# EAGLE design PACE (EAGLE 9.6.2)

## Sheet 1 of 3
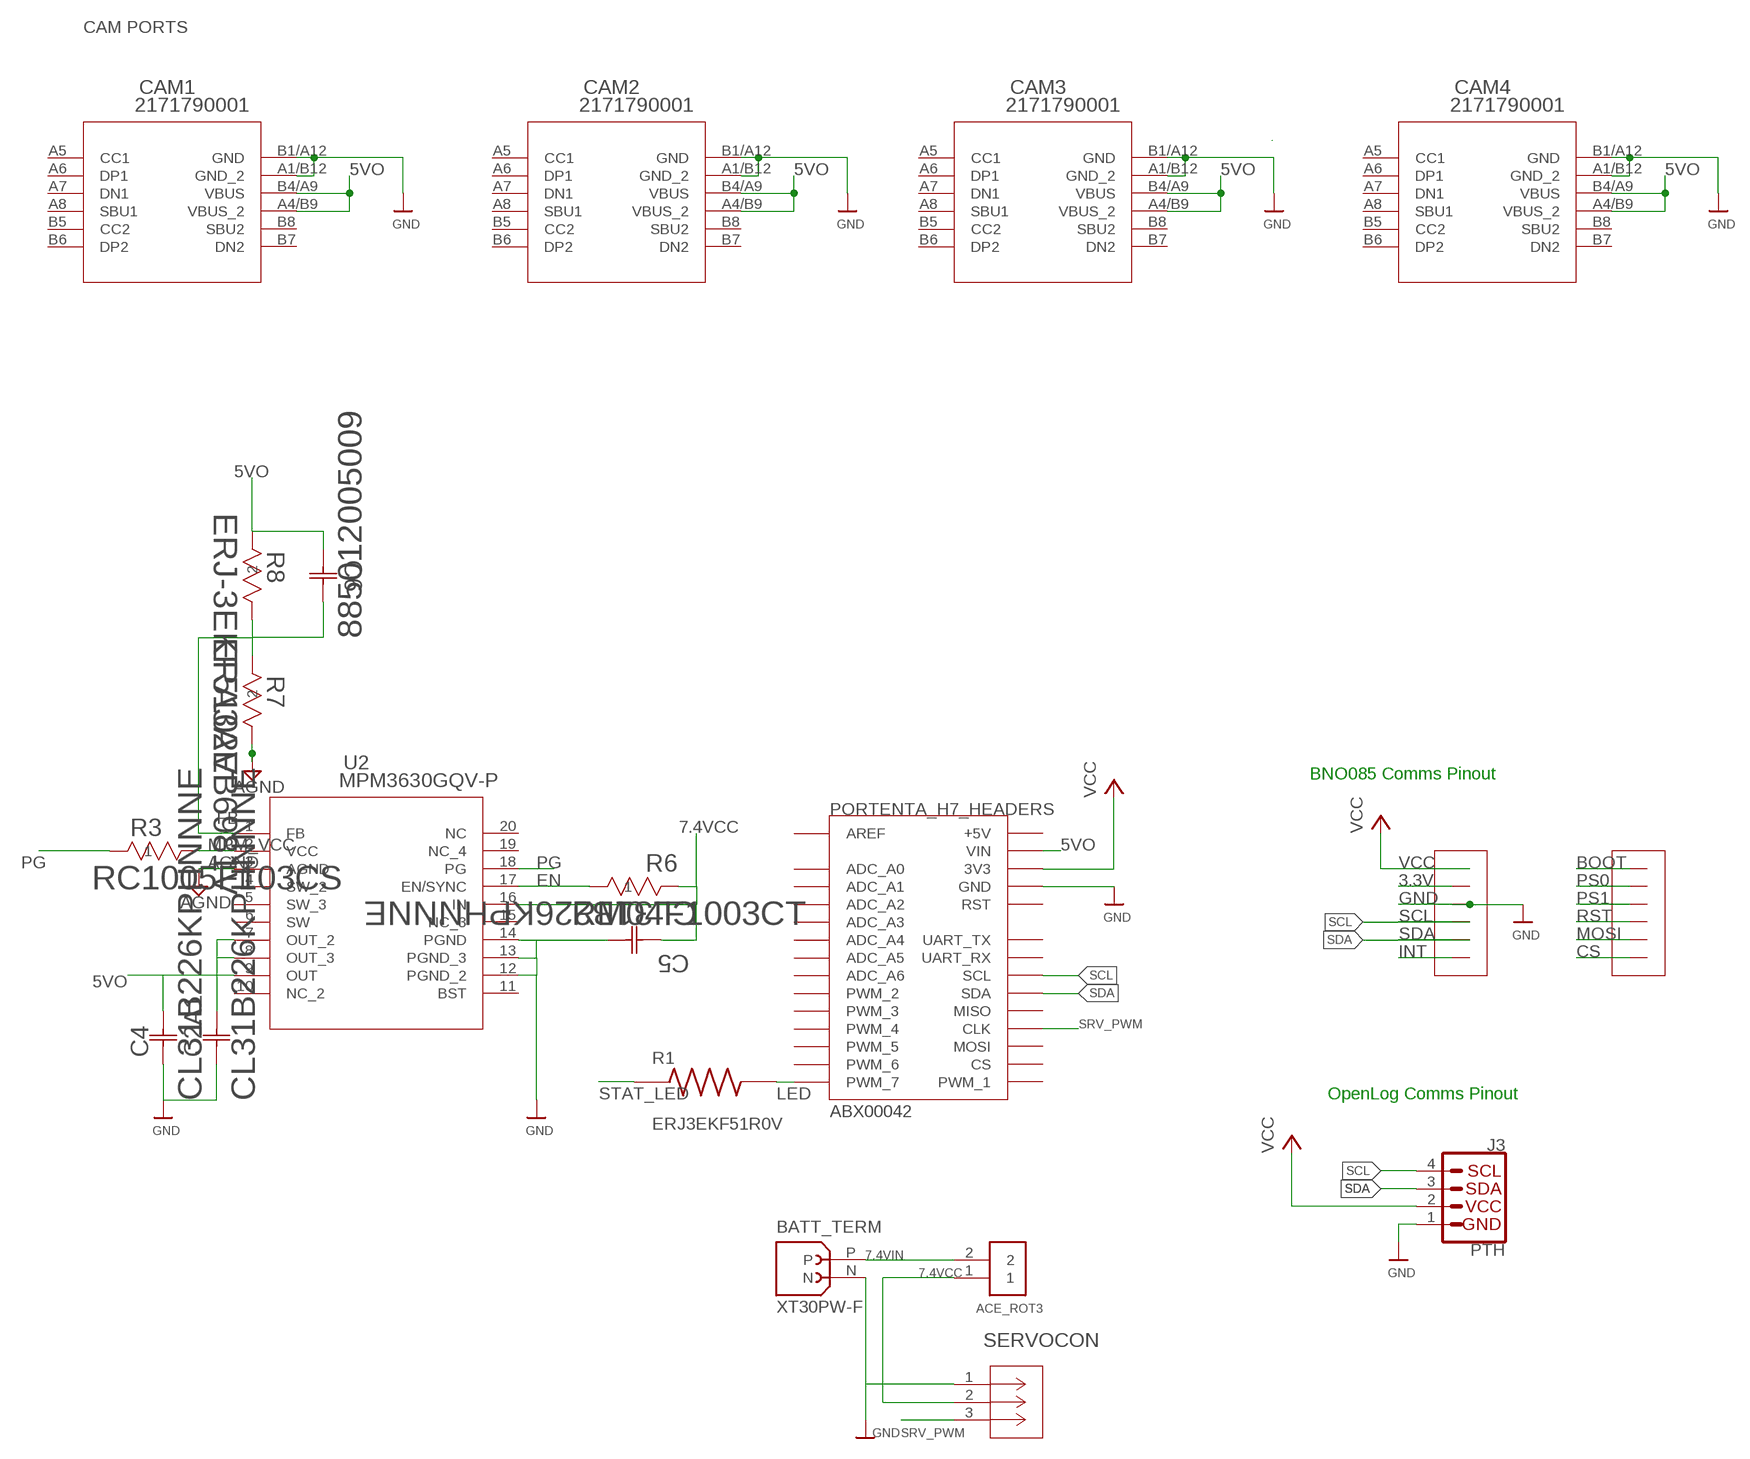
[diagram p0: schematic, sheet 1]

### Parts
ACE_ROT3  282837-2  [TE_282837-2]
BATT_TERM  XT30PW-F  [AMASS_XT30PW-F]
C2A1  CL31B226KPHNNNE  [CAP_CL31_SAM]
C4  CL31B226KPHNNNE  [CAP_CL31_SAM]
C5  CL31B226KPHNNNE  [CAP_CL31_SAM]
C6  885012005009  [CAP_885012005_WRE]
CAM1  2171790001  [2171790001_MOL]
CAM2  2171790001  [2171790001_MOL]
CAM3  2171790001  [2171790001_MOL]
CAM4  2171790001  [2171790001_MOL]
J3  PTH  I2C_STANDARD_NO_SILK  [1X04_NO_SILK]
R1  ERJ3EKF51R0V  [RES_ERJ3EKF51R0V]
R3  RC1005F103CS  [RES_1005_SAM]
R6  RM04F1003CT  [RES_RM04_CCE]
R7  ERA3AEB6981V  [RES_ERA3A_0603_PAN]
R8  ERJ-3EKF5102V  [RC0603N_PAN]
SERVOCON  B03B-PASK-1_(LF)_(SN)  [CONN_B03B-PASK-1_(LF)_(SN)_JST]
U2  MPM3630GQV-P  [QFN3P0X5P0X1P6_MPM3630_MNP]
U$5  ADAFRUIT_BNO08X  [ADAFRUIT_BNO08X_FOOTPRINT]
U$10  ABX00042_HEADERS_IO  [MODULE_ABX00042_HEADERS]

### Nets
5VO: C2A1.2 C4.2 C6.2 CAM1.A4/B9(VBUS_2) CAM1.B4/A9(VBUS) CAM2.A4/B9(VBUS_2) CAM2.B4/A9(VBUS) CAM3.A4/B9(VBUS_2) CAM3.B4/A9(VBUS) CAM4.A4/B9(VBUS_2) CAM4.B4/A9(VBUS) R8.2 U2.7(OUT_2) U2.8(OUT_3) U2.9(OUT) U$10.J16(VIN)
7.4VCC: ACE_ROT3.1 C5.1 R6.2 SERVOCON.2 U2.16(IN)
7.4VIN: ACE_ROT3.2 BATT_TERM.P
AGND: R7.1 U2.3(AGND)
EN: R6.1 U2.17(EN/SYNC)
FB: C6.1 R7.2 R8.1 U2.1(FB)
GND [lowpower]: BATT_TERM.N C2A1.1 C4.1 C5.2 CAM1.A1/B12(GND_2) CAM1.B1/A12(GND) CAM2.A1/B12(GND_2) CAM2.B1/A12(GND) CAM3.A1/B12(GND_2) CAM3.B1/A12(GND) CAM4.A1/B12(GND_2) CAM4.B1/A12(GND) J3.1(GND) SERVOCON.1 U2.12(PGND_2) U2.13(PGND_3) U2.14(PGND) U$5.GND U$10.J18(GND) ; also sheet 2,3
LED: R1.2 U$10.J9(PWM_7)
MPM_VCC: R3.2 U2.2(VCC)
PG: R3.1 U2.18(PG)
SCL: J3.4(SCL) U$5.SCL U$10.J22(SCL) ; also sheet 2,3
SDA: J3.3(SDA) U$5.SDA U$10.J23(SDA) ; also sheet 2,3
SRV_PWM: SERVOCON.3 U$10.J25(CLK)
STAT_LED: R1.1
VCC [lowpower]: J3.2(VCC) U$5.VIN(VCC) U$10.J17(3V3) ; also sheet 2,3
Unconnected: CAM1.A5(CC1) CAM1.A6(DP1) CAM1.A7(DN1) CAM1.A8(SBU1) CAM1.B5(CC2) CAM1.B6(DP2) CAM1.B7(DN2) CAM1.B8(SBU2) CAM2.A5(CC1) CAM2.A6(DP1) CAM2.A7(DN1) CAM2.A8(SBU1) CAM2.B5(CC2) CAM2.B6(DP2) CAM2.B7(DN2) CAM2.B8(SBU2) CAM3.A5(CC1) CAM3.A6(DP1) CAM3.A7(DN1) CAM3.A8(SBU1) CAM3.B5(CC2) CAM3.B6(DP2) CAM3.B7(DN2) CAM3.B8(SBU2) CAM4.A5(CC1) CAM4.A6(DP1) CAM4.A7(DN1) CAM4.A8(SBU1) CAM4.B5(CC2) CAM4.B6(DP2) CAM4.B7(DN2) CAM4.B8(SBU2) U2.4(SW_2) U2.5(SW_3) U2.6(SW) U2.10(NC_2) U2.11(BST) U2.15(NC_3) U2.19(NC_4) U2.20(NC) U$5.3VO(3.3V) U$5.BT(BOOT) U$5.CS U$5.DI(MOSI) U$5.INT U$5.P0(PS0) U$5.P1(PS1) U$5.RST U$10.J1(AREF) U$10.J2(ADC_A0) U$10.J3(ADC_A1) U$10.J4(ADC_A2) U$10.J5(ADC_A3) U$10.J6(ADC_A4) U$10.J7(ADC_A5) U$10.J8(ADC_A6) U$10.J10(PWM_6) U$10.J11(PWM_5) U$10.J12(PWM_4) U$10.J13(PWM_3) U$10.J14(PWM_2) U$10.J15(+5V) U$10.J19(RST) U$10.J20(UART_TX) U$10.J21(UART_RX) U$10.J24(MISO) U$10.J26(MOSI) U$10.J27(CS) U$10.J28(PWM_1)

### Notes on the sheet
- CAM PORTS
- BNO085 Comms Pinout
- OpenLog Comms Pinout

## Sheet 2 of 3
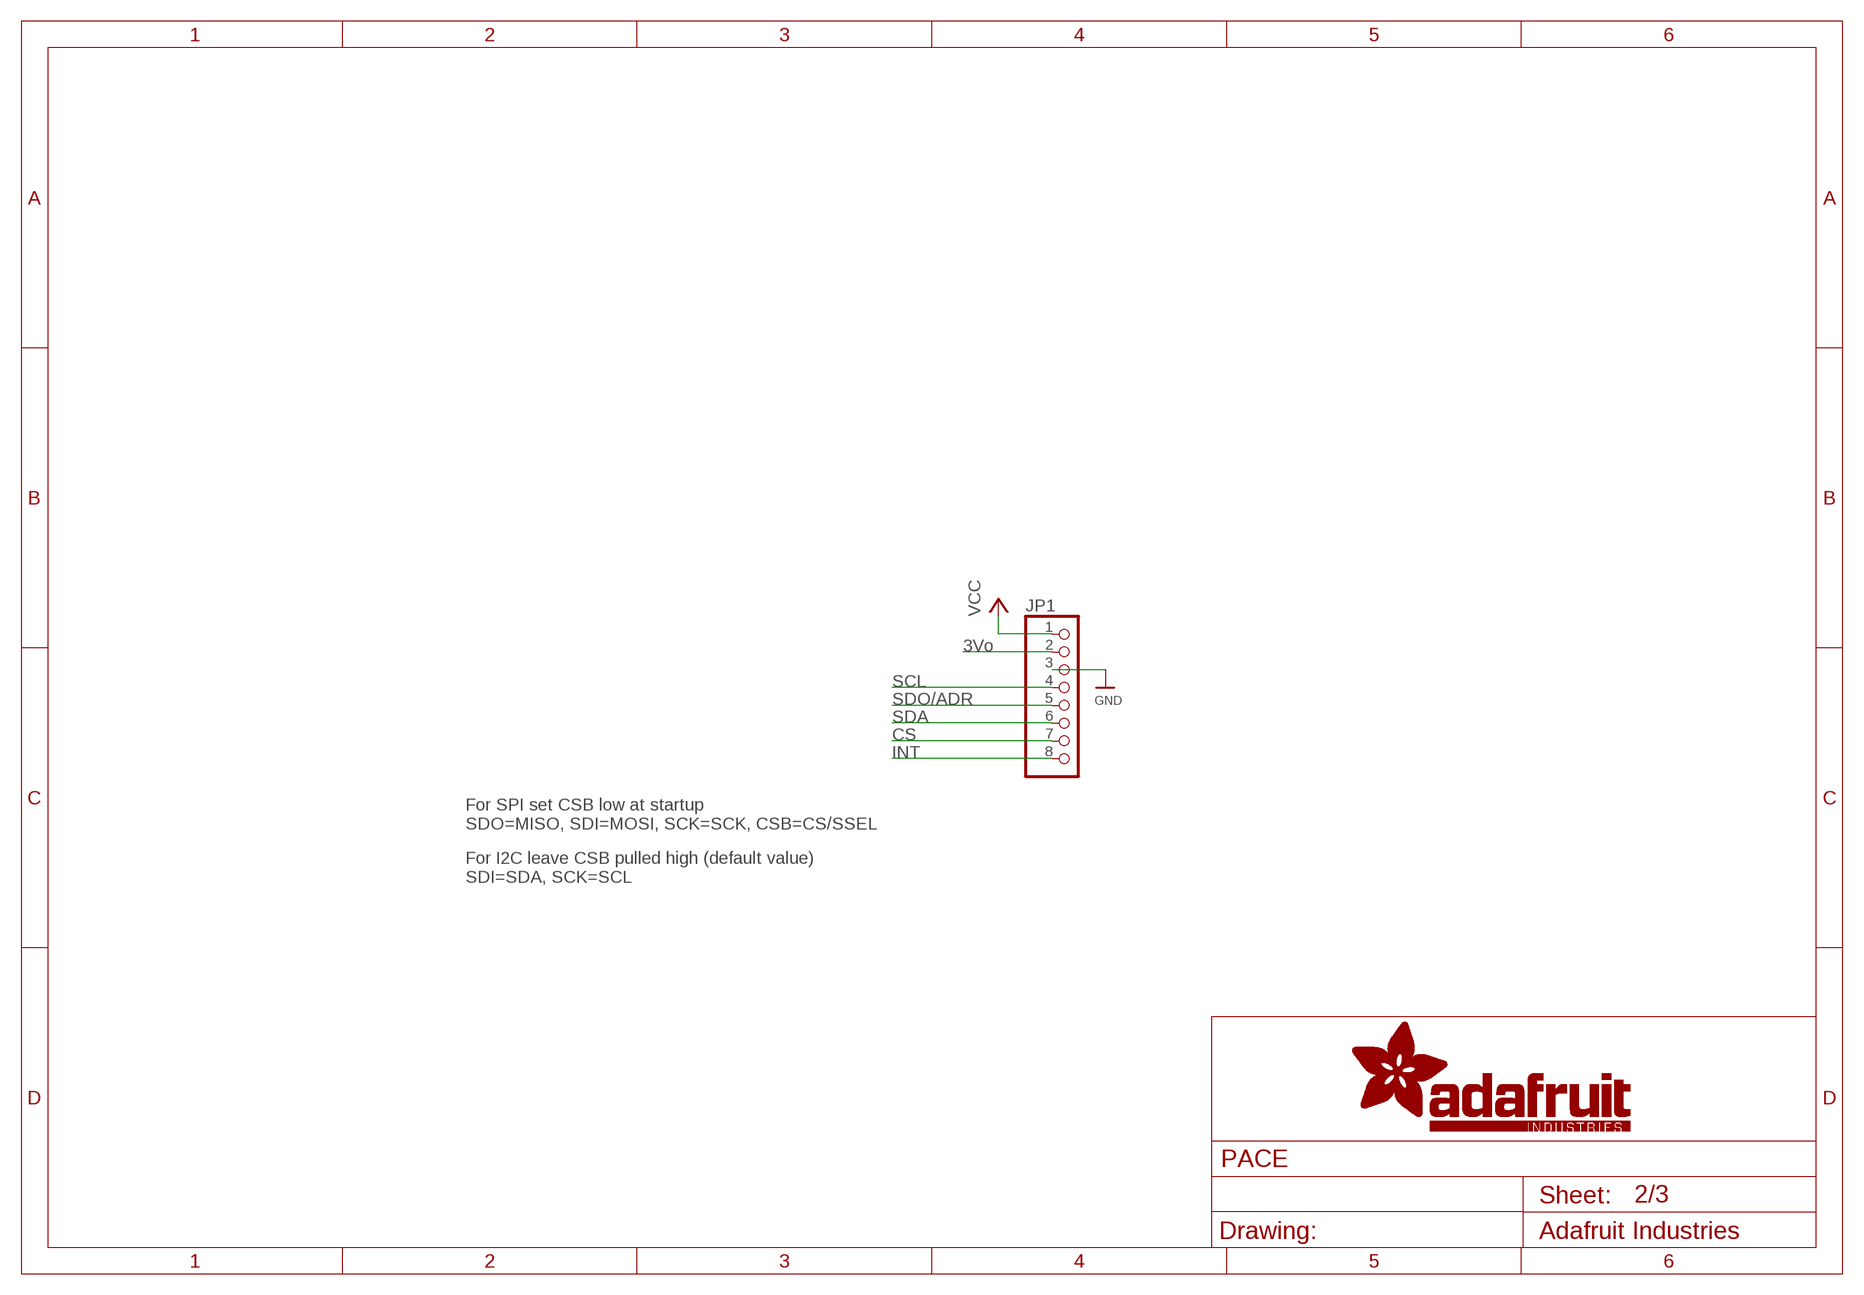
[diagram p1: schematic, sheet 2]

### Parts
JP1  HEADER-1X870MIL  [1X08_ROUND_70]

### Nets
CS: JP1.7
GND [lowpower]: JP1.3 ; also sheet 1,3
INT: JP1.8
N$2 [lowpower]: JP1.2
SCL: JP1.4 ; also sheet 1,3
SDA: JP1.6 ; also sheet 1,3
SDO/ADR: JP1.5
VCC [lowpower]: JP1.1 ; also sheet 1,3

### Notes on the sheet
- 3Vo
- For SPI set CSB low at startup
  SDO=MISO, SDI=MOSI, SCK=SCK, CSB=CS/SSEL
- For I2C leave CSB pulled high (default value)
  SDI=SDA, SCK=SCL

## Sheet 3 of 3
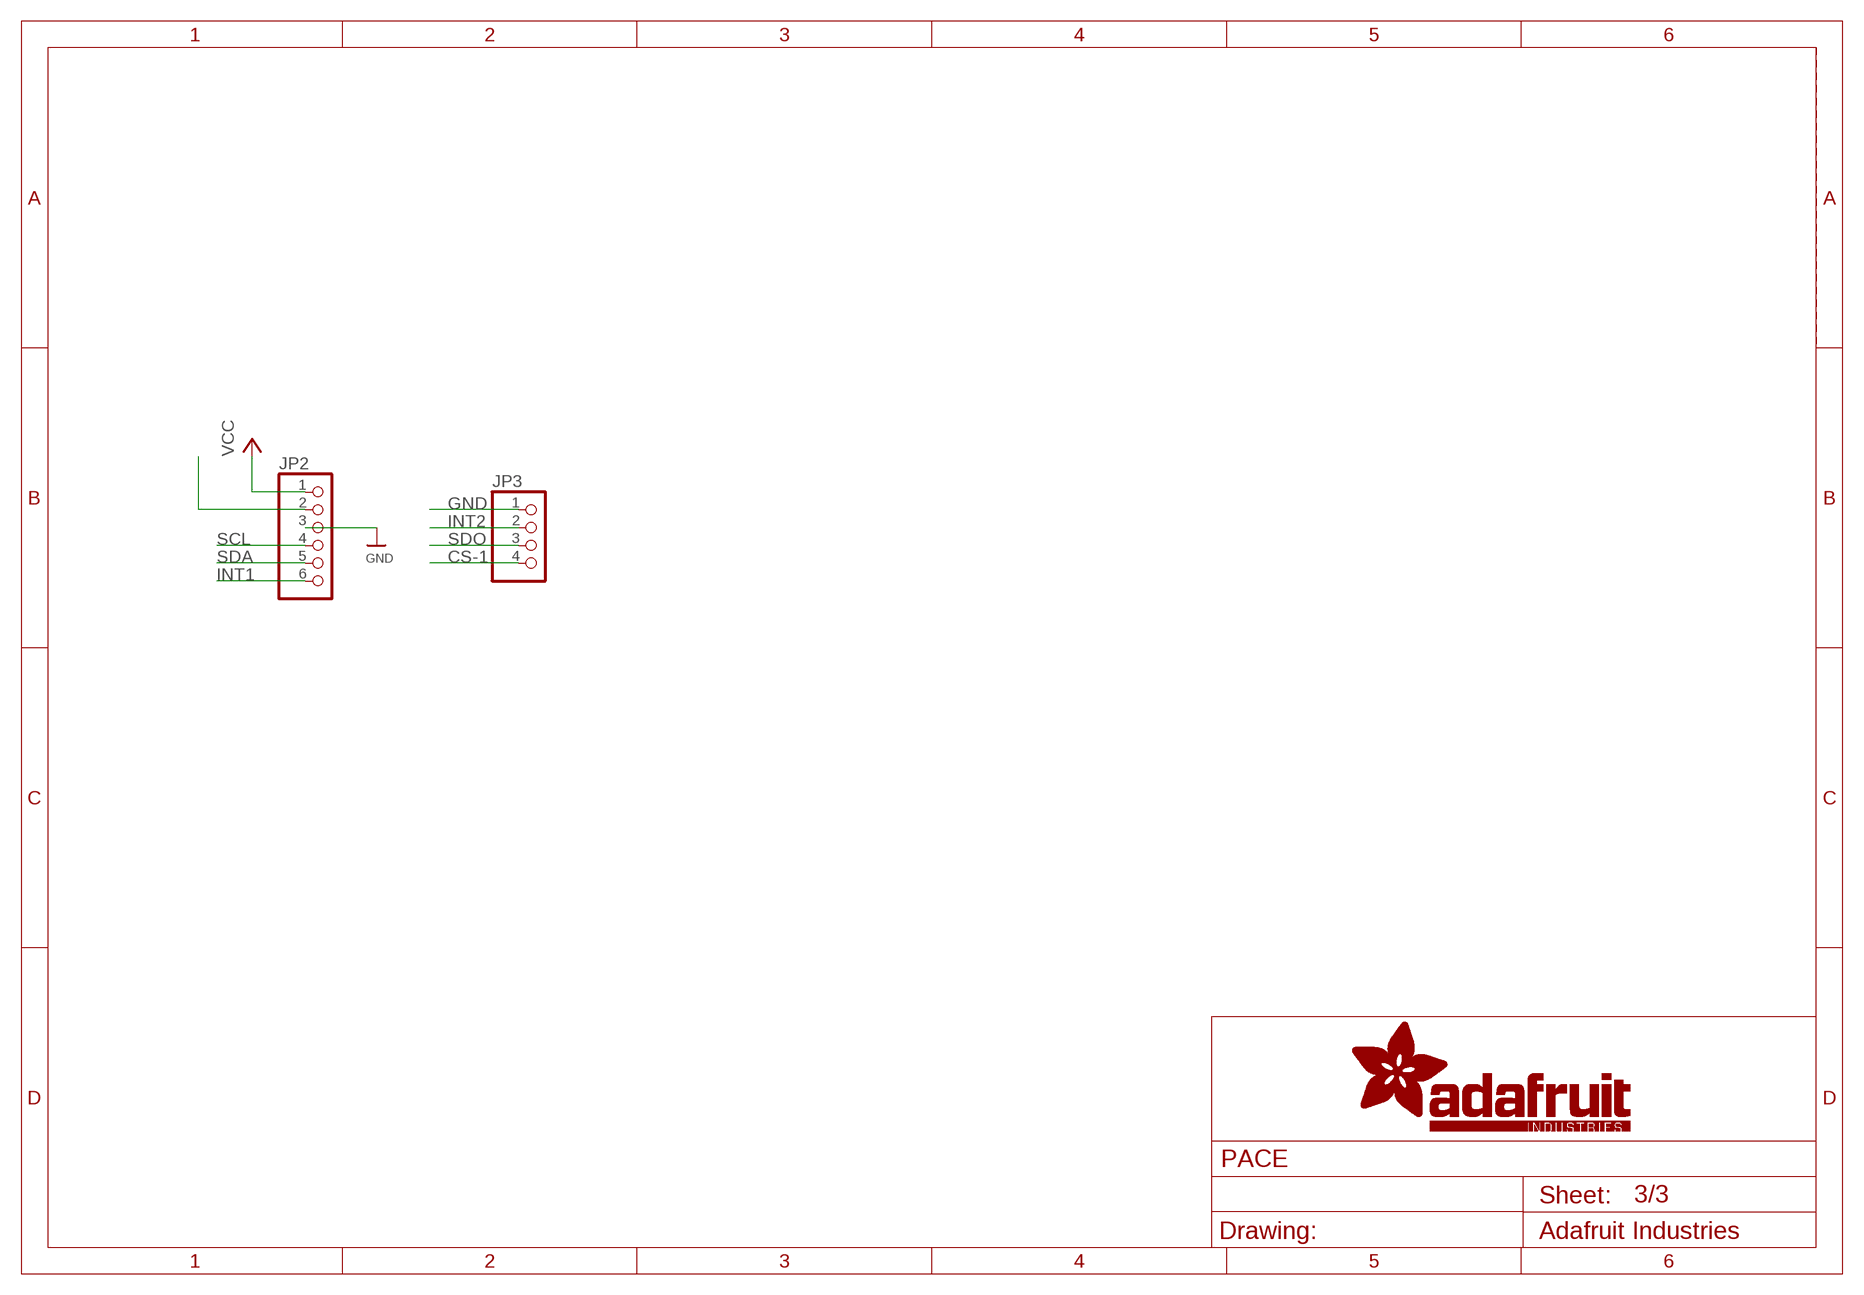
[diagram p2: schematic, sheet 3]

### Parts
JP2  HEADER-1X670MIL  [1X06_ROUND_70]
JP3  HEADER-1X4ROUND  [1X04_ROUND]

### Nets
CS-1: JP3.4
GND [lowpower]: JP2.3 JP3.1 ; also sheet 1,2
INT1: JP2.6
INT2: JP3.2
N$1 [lowpower]: JP2.2
SCL: JP2.4 ; also sheet 1,2
SDA: JP2.5 ; also sheet 1,2
SDO: JP3.3
VCC [lowpower]: JP2.1 ; also sheet 1,2

## Library data of the parts
ACE_ROT3 = 282837-2:282837-2: TERM BLOCK 5.08MM 2POS SIDE ENTY Check availability <https://pricing.snapeda.com/parts/282837-2/TE%20Connectivity/view-part?ref=eda>; AVAILABILITY: In Stock; CHECK_PRICES: https://www.snapeda.com/parts/282837-2/TE+Connectivity+AMP+Connectors/view-part/?ref=eda; COMMENT: 282837-2; DESCRIPTION: Terminal Block Connector Wire Receptacle 2 5.08 mm 30-16 AWG Green 13.5 A 250 V | TE Connectivity 282837-2; MF: TE Connectivity; MP: 282837-2; PACKAGE: None; PRICE: None; PURCHASE-URL: https://www.snapeda.com/api/url_track_click_mouser/?unipart_id=2549980&manufacturer=TE Connectivity&part_name=282837-2&search_term=None; SNAPEDA_LINK: https://www.snapeda.com/parts/282837-2/TE+Connectivity+AMP+Connectors/view-part/?ref=snap
BATT_TERM = XT30PW-F:XT30PW-F: Check availability <https://pricing.snapeda.com/parts/XT30PW-F/amass/view-part?ref=eda>; AVAILABILITY: Not in stock; CHECK_PRICES: https://www.snapeda.com/parts/XT30PW-F/AMASS/view-part/?ref=eda; DESCRIPTION: Socket; DC supply; XT30; female; PIN: 2; on PCBs; THT; yellow; 15A; MF: amass; MP: XT30PW-F; PACKAGE: None; PRICE: None; SNAPEDA_LINK: https://www.snapeda.com/parts/XT30PW-F/AMASS/view-part/?ref=snap
C2A1 C4 C5 = 22uF_Capacitor:CL31B226KPHNNNE; COPYRIGHT: Copyright (C) 2024 Ultra Librarian. All rights reserved.; MANUFACTURER_PART_NUMBER: CL31B226KPHNNNE; MFR_NAME: Samsung
C6 = 22pF_Capacitor:885012005009; COPYRIGHT: Copyright (C) 2024 Ultra Librarian. All rights reserved.; MANUFACTURER_PART_NUMBER: 885012005009; MFR_NAME: Wurth Electronics
CAM1-CAM4 = MOLEX-2171790001-USB_C:2171790001; COPYRIGHT: Copyright (C) 2024 Ultra Librarian. All rights reserved.; MANUFACTURER_PART_NUMBER: 2171790001; MFR_NAME: Molex Connector Corporation
J3 = SparkX:I2C_STANDARD: SparkFun I2C Standard Pinout Header SparkFun has standardized on a pinout for all I2C based sensor breakouts. This pinout allows I2C boards to be plugged directly into the headers on Arduino Uno compatible boards, and to be daisy chained easily. Example SparkFun Products: SparkFun Atmospheric Sensor Breakout - BME280 <https://www.sparkfun.com/products/13676> SparkFun Altitude/Pressure Sensor Breakout - MPL3115A2 <https://www.sparkfun.com/products/11084> SparkFun TOF Range Finder Sensor - VL6180 <https://www.sparkfun.com/products/12785>
JP1 = microbuilder:HEADER-1X8: PIN HEADER
JP2 = microbuilder:HEADER-1X6: PIN HEADER
JP3 = microbuilder:HEADER-1X4: PIN HEADER
R1 = ERJ3EKF51R0V-51Ohm-Resistor:ERJ3EKF51R0V; MANUFACTURER: Panasonic; MAXIMUM_PACKAGE_HEIGHT: 0.45 mm; PARTREV: 3/1/2020; STANDARD: Manufacturer Recommendations
R3 = 10kO_Resistor:RC1005F103CS; COPYRIGHT: Copyright (C) 2024 Ultra Librarian. All rights reserved.; MANUFACTURER_PART_NUMBER: RC1005F103CS; MFR_NAME: Samsung
R6 = 100kO_Resistor:RM04F1003CT; COPYRIGHT: Copyright (C) 2024 Ultra Librarian. All rights reserved.; MANUFACTURER_PART_NUMBER: RM04F1003CT; MFR_NAME: Cal-Chip Electronics
R7 = 6_98kO_Resistor:ERA3AEB6981V; COPYRIGHT: Copyright (C) 2024 Ultra Librarian. All rights reserved.; MANUFACTURER_PART_NUMBER: ERA3AEB6981V; MFR_NAME: Panasonic
R8 = 51kO_Resistor:ERJ-3EKF5102V; COPYRIGHT: Copyright (C) 2024 Ultra Librarian. All rights reserved.; MANUFACTURER_PART_NUMBER: ERJ-3EKF5102V; MFR_NAME: Panasonic
SERVOCON = 3_Pin_JST_XA_Surface_Connector:B03B-PASK-1_(LF)_(SN); COPYRIGHT: Copyright (C) 2024 Ultra Librarian. All rights reserved.; DIGIKEY_PART_NUMBER_1: 455-1833-ND; MANUFACTURER_PART_NUMBER: B03B-PASK-1 (LF) (SN); MFR_NAME: JST
U2 = MPM3630:MPM3630GQV-P; COPYRIGHT: Copyright (C) 2024 Ultra Librarian. All rights reserved.; MANUFACTURER_PART_NUMBER: MPM3630GQV-P; MFR_NAME: Monolithic Power Systems
U$5 = ADAFRUIT_BNO08x:ADAFRUIT_BNO08X: Adafruit BNO08x Device
U$10 = ABX00042:ABX00042_HEADERS_IO: Device for Portenta H7 pin headers IO

## Net classes
1 highpower: width 0.305 mm, drill 0.483 mm
2 lowpower: width 0.254 mm, drill 0.483 mm

## Board
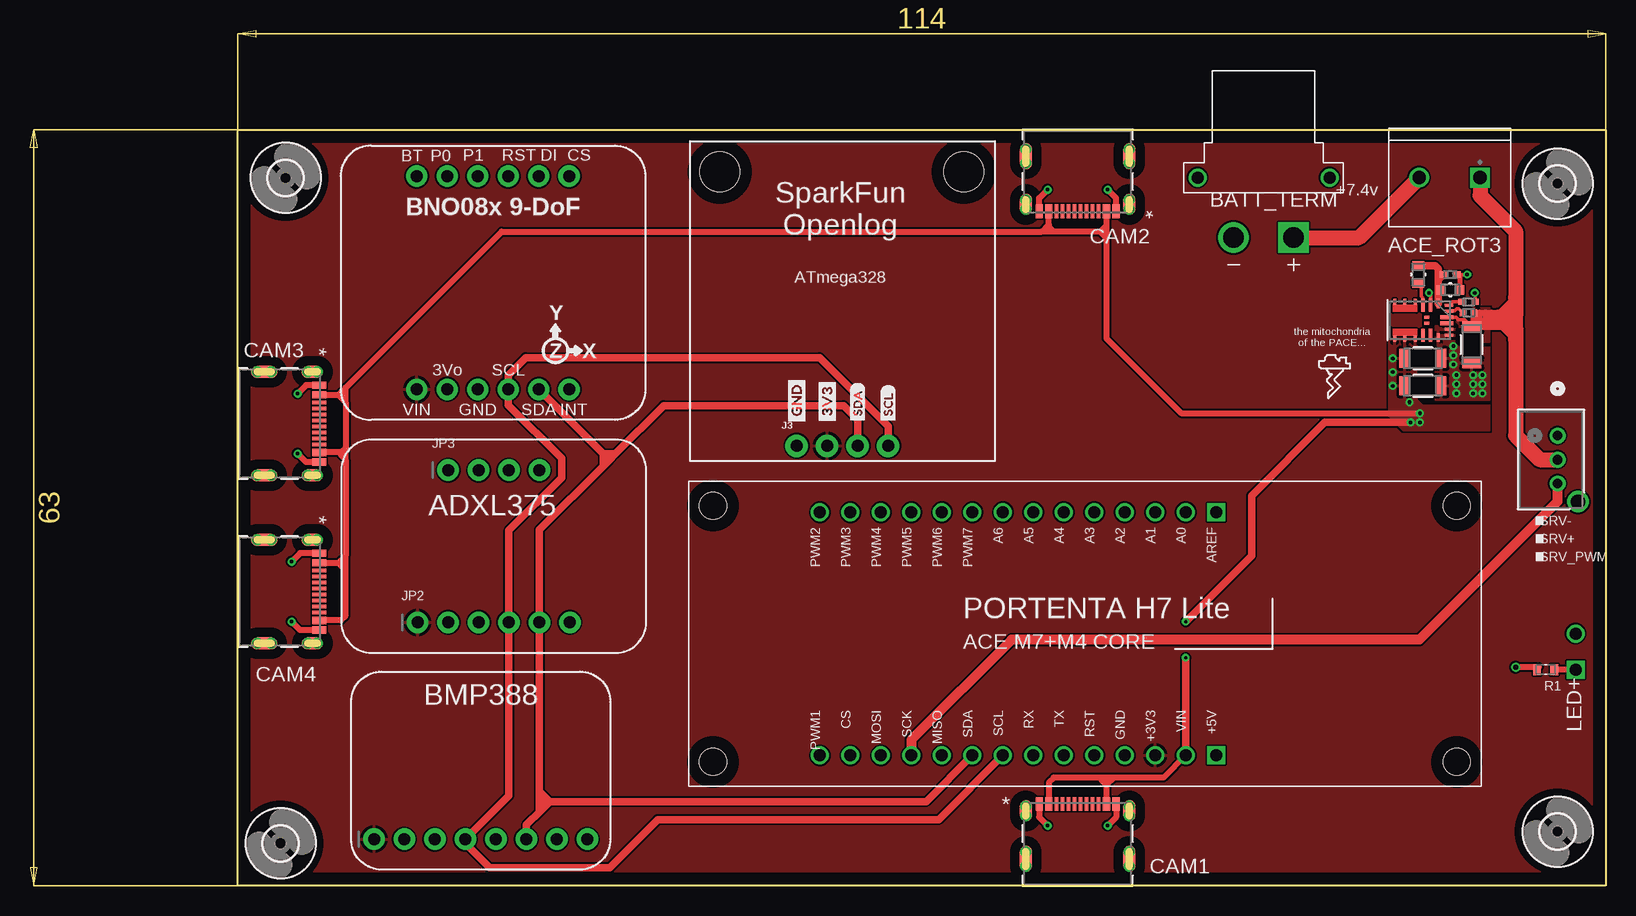
[diagram p3: board, top side]
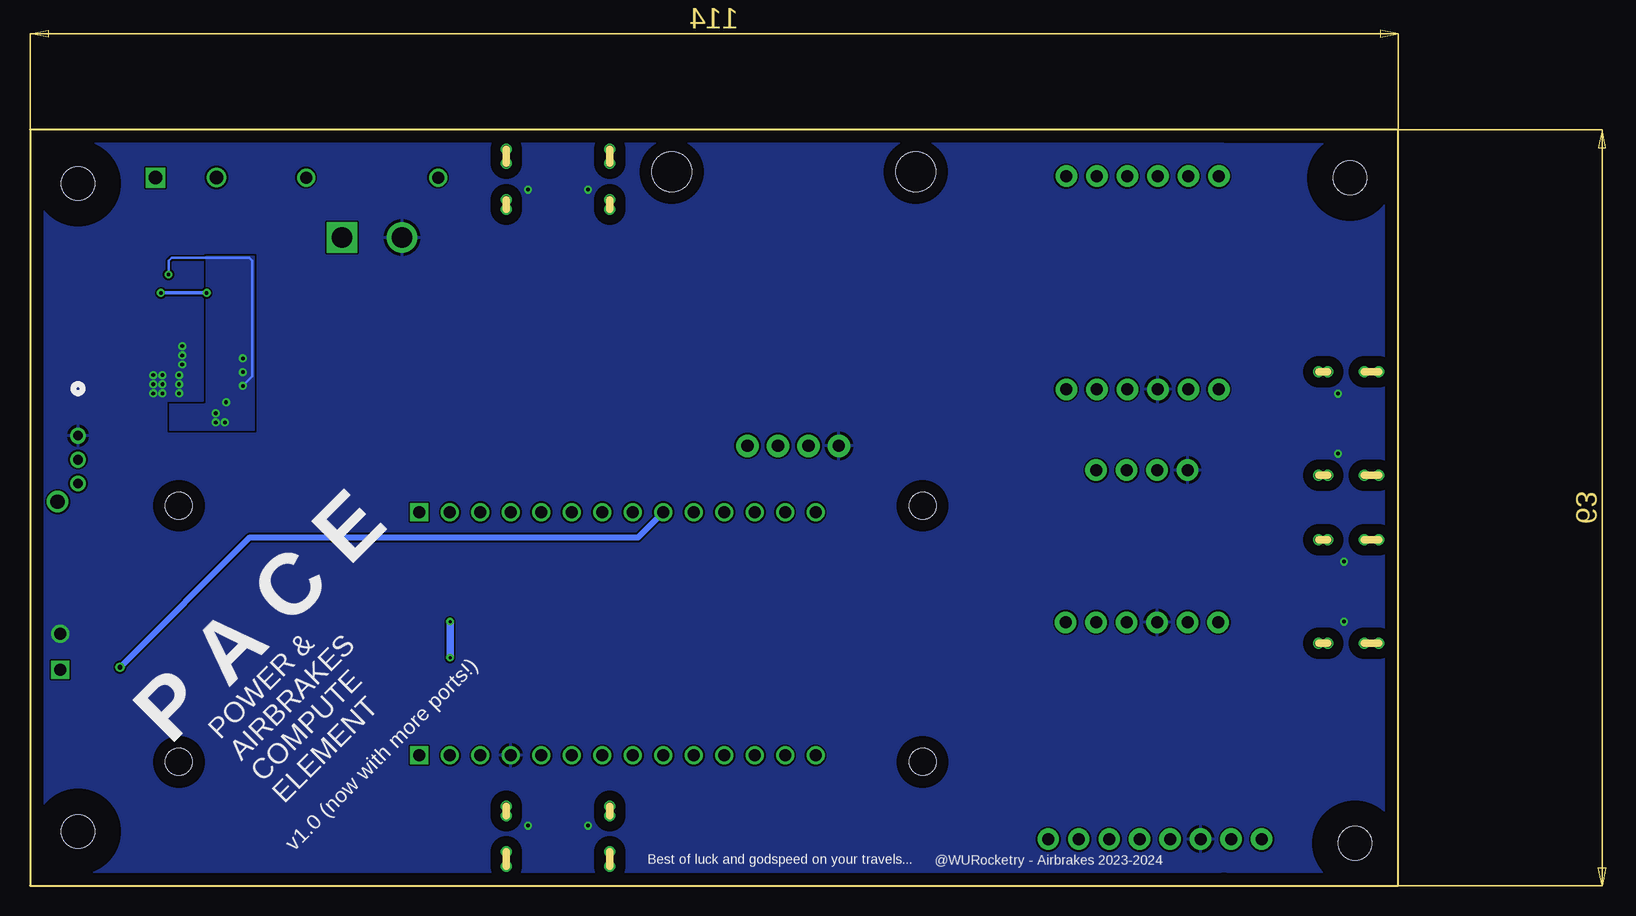
[diagram p4: board, bottom side, seen from below]

Size 114 x 63 mm. Coordinates in mm from the lower left corner, seen from the top.
Outline: 0,63 114,63 114,0 0,0 0,63
Copper layers (1*16): Top 0.035mm / dielectric 1.5mm / Bottom 0.035mm
Design rules "default *": minimum track width 6mil, minimum drill 0.2mm, track to track 6mil, track to pad 6mil, pad to pad 6mil, via to via 6mil, smd to smd 6mil, copper to edge 40mil, drill to drill 8mil, minimum pad ring 5mil, minimum via ring 7mil, stop-mask expansion 4mil, vias tented up to drill 0mil, thermal gap 10mil

### Footprints (pad centres in the part's own frame; a part is rotated, then mirrored left to right if it is on the bottom)
TE_282837-2 = drill 1.1 square: 1 -2.54,0 | drill 1.1: 2 2.54,0
AMASS_XT30PW-F = drill 1.7: N -2.5,-5 | drill 1.7 square: P 2.5,-5 | drill 1: S1 5.5,0; S2 -5.5,0
CAP_CL31_SAM = smd 0.856 x 1.6: 1 -1.528,0; 2 1.528,0
CAP_885012005_WRE = smd 0.66 x 0.559: 1 -0.546,0; 2 0.546,0
2171790001_MOL = smd 0.991 x 2.21: 13 -4.32,-1.272; 14 4.32,-1.272 | smd 0.991 x 1.803: 15 -4.32,2.728; 16 4.32,2.728 | smd 0.61 x 1.143: A1/B12 -3.2,3.303; A4/B9 -2.4,3.303; B1/A12 3.2,3.303; B4/A9 2.4,3.303 | smd 0.305 x 1.143: A5 -1.25,3.303; A6 -0.25,3.303; A7 0.25,3.303; A8 1.25,3.303; B5 1.75,3.303; B6 0.75,3.303; B7 -0.75,3.303; B8 -1.75,3.303 | drill 0.61 pad 0.61: S_1_H1 -4.318,-0.686; S_1_H2 -4.318,-1.88; S_2_H1 4.318,-0.686; S_2_H2 4.318,-1.88; S_3_H1 -4.318,3.124; S_3_H2 -4.318,2.337; S_4_H1 4.318,3.124; S_4_H2 4.318,2.337
1X04_NO_SILK = drill 1.016 pad 1.88: 1 0,0; 2 2.54,0; 3 5.08,0; 4 7.62,0
1X08_ROUND_70 = drill 1 pad 1.778: 1 -8.89,0; 2 -6.35,0; 3 -3.81,0; 4 -1.27,0; 5 1.27,0; 6 3.81,0; 7 6.35,0; 8 8.89,0
1X06_ROUND_70 = drill 1 pad 1.778: 1 -6.35,0; 2 -3.81,0; 3 -1.27,0; 4 1.27,0; 5 3.81,0; 6 6.35,0
1X04_ROUND = drill 1 pad 1.778: 1 -3.81,0; 2 -1.27,0; 3 1.27,0; 4 3.81,0
STAND-OFF = hole 3.302: 0,0
RES_ERJ3EKF51R0V = smd 0.65 x 0.9: 1 -0.725,0; 2 0.725,0
RES_1005_SAM = smd 0.606 x 0.5: 1 -0.553,0; 2 0.553,0
RES_RM04_CCE = smd 0.508 x 0.559: 1 -0.47,0; 2 0.47,0
RES_ERA3A_0603_PAN = smd 0.711 x 0.991: 1 -0.749,0; 2 0.749,0
RC0603N_PAN = smd 0.756 x 0.8: 1 -0.778,0; 2 0.778,0
CONN_B03B-PASK-1_(LF)_(SN)_JST = drill 0.813 pad 1.321: 1 0,0; 2 2.007,0; 3 3.988,0 | drill 1.194 pad 1.194: 4 5.512,1.702
QFN3P0X5P0X1P6_MPM3630_MNP = smd 0.813 x 0.254: 1 -1.394,1.55 | smd 1.092 x 0.305: 2 -1.254,0.9; 3 -1.254,0.25; 10 1.254,0.25; 11 1.254,0.9 | smd 0.508 x 0.254: 4 -1.546,-0.4; 5 -1.546,-1.25; 6 -1.546,-2.1; 7 1.546,-2.1; 8 1.546,-1.25; 9 1.546,-0.4 | smd 0.711 x 0.254: 12 1.444,1.55 | smd 0.254 x 0.711: 13 1.25,2.444; 14 0.75,2.444; 17 -0.75,2.444; 18 -1.25,2.444 | smd 0.305 x 1.092: 15 0.25,2.254; 16 -0.25,2.254 | smd 0.254 x 0.406: 19 -0.25,0.575; 20 0.25,0.575
ADAFRUIT_BNO08X_FOOTPRINT = drill 1 pad 1.778: 3VO 10.16,3.81; BT 7.62,21.59; CS 20.32,21.59; DI 17.78,21.59; GND 12.7,3.81; INT 20.32,3.81; P0 10.16,21.59; P1 12.7,21.59; RST 15.24,21.59; SCL 15.24,3.81; SDA 17.78,3.81; VIN 7.62,3.81
MODULE_ABX00042_HEADERS = drill 1 square: J1 -10.135,10.947; J15 10.135,10.947 | drill 1: J2 -10.135,8.407; J3 -10.135,5.867; J4 -10.135,3.327; J5 -10.135,0.787; J6 -10.135,-1.753; J7 -10.135,-4.293; J8 -10.135,-6.833; J9 -10.135,-9.373; J10 -10.135,-11.913; J11 -10.135,-14.453; J12 -10.135,-16.993; J13 -10.135,-19.533; J14 -10.135,-22.073; J16 10.135,8.407; J17 10.135,5.867; J18 10.135,3.327; J19 10.135,0.787; J20 10.135,-1.753; J21 10.135,-4.293; J22 10.135,-6.833; J23 10.135,-9.373; J24 10.135,-11.913; J25 10.135,-14.453; J26 10.135,-16.993; J27 10.135,-19.533; J28 10.135,-22.073 | hole 2.25: -10.67,30.99; 10.67,30.99; 10.67,-30.99; -10.67,-30.99
2,8 = hole 2.8: 0,0

### Placement (x,y rotation side)
ACE_ROT3  101,59 180 top
BATT_TERM  85.5,59 0 top
C2A1  98.77,41.65 180 top
C4  98.77,43.94 180 top
C5  102.84,45.08 270 top
C6  101.06,50.92 0 top
CAM1  70,3.5 0 top
CAM2  70,59.5 180 top
CAM3  3.5,38.5 270 top
CAM4  3.5,24.5 270 top
J3  46.59,36.65 0 top
JP1  20.26,3.87 0 top
JP2  21.35,21.93 0 top
JP3  21.35,34.63 0 top
JP4  STAND-OFF  [STAND-OFF]  40.19,59.49 0 top
JP5  STAND-OFF  [STAND-OFF]  60.51,59.49 0 top
R1  109,18 180 top
R3  102.58,48.63 0 top
R6  102.58,47.74 0 top
R7  98.39,50.92 90 top
R8  101.06,49.65 0 top
SERVOCON  110,37.5 270 top
U2  98.52,47.11 270 top
U$5  7.31,37.53 0 top
U$8  [3V3-03]  49.13,38.3 90 top
U$9  [GND-03]  46.59,38.3 90 top
U$10  70.6,20.98 270 top
U$13  [2,8]  4,58.98 0 top
U$14  [2,8]  110,58.5 0 top
U$15  [2,8]  3.59,3.53 0 top
U$16  [SDA1]  51.67,38.42 90 top
U$19  [SCL2]  54.21,38.42 90 top
U$29  [2,8]  110,4.5 0 top

### Tracks (layer width: path | path; a pad name or v marks a point on that pad's centre or on a via)
5VO  (via drill 0.25, 0.3, 0.3 pad 0.55)
  Top 0.305: C6.2 v102.46,50.92
  Top 0.406: C6.2 101.84,50.69 R8.2
  Top 0.508: v79.01,18.99 v79,19 | CAM2.A4/B9 72.4,55 | 72.4,55 72.4,54 | 72.4,54 72.4,45.6 78.64,39.36 v98.52,39.36 | 72.4,54 71.9,54.5 | 71.9,54.5 68,54.5 | 68,54.5 67.6,54.9 67.6,55.1 | 72.4,55 71.9,54.5 | 68,54.5 67,54.5 | 67,54.5 22,54.5 9,41.5 | CAM3.A4/B9 8.4,40.9 | 9,41.5 8.4,40.9 | 8.4,40.9 9,40.3 | 9,40.3 9,36.5 | 9,36.5 8.6,36.1 | 8.6,36.1 CAM3.B4/A9 | 8.6,36.1 8.6,35.9 9,35.5 | 9,35.5 9,27.5 | 9,27.5 8.4,26.9 | CAM4.A4/B9 8.4,26.9 | 8.4,26.9 9,26.3 | CAM4.B4/A9 8.6,22.1 9,22.5 9,26.3 | 9,26.3 9,27.5 | 9,35.5 9,36.5 | 9,40.3 9,41.5 | 67,54.5 67.6,55.1 | 67.6,55.1 CAM2.B4/A9 | U$10.J16 77.16,9 73,9 | 73,9 72.4,8.4 | 72.4,8.4 CAM1.B4/A9 | 73,9 72,9 | 72,9 68,9 67.6,8.6 CAM1.A4/B9 | 72.4,8.4 72,8.8 72,9
  Top 0.61: U$10.J16 v79.01,18.99 | v79,22 84.5,27.5 84.5,32.5 90.6,38.6 v97.76,38.6
  Bottom 0.203: v96.26,41.65 95.47,42.44 95.47,52.06 95.73,52.32 102.2,52.32 102.46,52.06 v102.46,50.92
  Bottom 0.61: v79,19 v79,22
  other vias: 98.52,38.6 97.66,40.28 96.26,42.79 96.26,43.94
  pour Top: 104.36,40 98.77,40 98.27,40.51 98.27,46.35 95.93,46.35 95.93,39.16 97.12,37.97 104.36,37.97
  pour Bottom: 102.33,40.12 99.41,40.12 99.28,40.25 99.28,52.44 95.34,52.44 95.34,37.97 102.33,37.97
7.4VCC
  Top 0.305: C5.1 102.28,47.16 101.73,47.16 101.53,47.36 U2.16
  Top 0.508: 103.5,47.74 R6.2 103.05,46.82 C5.1 103.5,47.27 103.5,47.74 | 103.5,47.74 104,47.74 | 104,47.74 104.5,47.74 | 104.5,47.74 105,47.74 | 105,47.74 105.25,47.74 | 104,47.74 104,47 | 104.5,47 104.5,47.74 | 105,47 105,47.5 | 105,47.5 105,47.74 | 105.5,47.74 105.5,47 | 106,47.74 106.25,47.74 106.5,47.5 105,47.5
  Top 0.61: 105.39,46.61 106.39,46.61 106.5,46.5 | 106.5,49 105.25,47.74 105.5,47.74 106,47.74 | 105.39,46.61 106.5,45.5 | 105.39,46.61 C5.1 103.23,47 104,47 104.5,47 105,47 105.5,47 106,47 106.5,47.5
  Top 1.27: ACE_ROT3.1 103.54,57.5 106.5,54.54 106.5,49 106.5,47.5 106.5,46.5 106.5,45.5 106.5,37.5 108.51,35.49 SERVOCON.2
  pour Top: 104.36,48.13 102.84,48.13 102.84,47.36 102.71,47.24 101.69,47.24 101.44,47.49 101.19,47.49 101.19,47.24 101.31,47.24 101.82,46.73 101.82,45.33 104.36,45.33
7.4VIN
  Top 1.27: ACE_ROT3.2 93.46,54 BATT_TERM.P
AGND
  Top 0.305: U2.3 98.77,48.98 98.62,49.12 98.62,49.94
  Top 0.406: R7.1 98.62,49.94
EN
  Top 0.305: R6.1 101.78,48.08 101.6,48.08 101.42,47.9 101.01,47.9 U2.17
FB
  Top 0.406: R8.1 100.07,49.44 U2.1
  Top 0.61: C6.1 100.07,50.48 U2.1 100.07,51.39 99.79,51.67 R7.2
GND  (via drill 0.3, 0.3 pad 0.55, 1)
  Top 0.508: CAM4.B1/A12 5.2,21.3 v4.5,22 | CAM4.A1/B12 5.2,27.7 v4.5,27 | CAM3.B1/A12 5.7,35.3 v5,36 | CAM3.A1/B12 5.7,41.7 v5,41 | CAM2.B1/A12 66.8,57.3 v67.5,58 | CAM2.A1/B12 73.2,57.3 v72.5,58 | CAM1.B1/A12 73.2,5.7 v72.5,5 | CAM1.A1/B12 66.8,5.7 v67.5,5
  other vias: 103.73,42.54 103.73,41.78 103.73,41.01 102.97,41.01 102.97,41.78 102.97,42.54 101.57,42.54 101.57,41.78 101.57,41.01 101.31,43.43 101.31,44.19 101.31,44.95 111.5,21
  pour Bottom (rank 3): 0,63 114,63 114,0 0,0
  pour Top: 104.36,44.82 101.82,44.82 101.44,45.2 101.44,46.48 100.17,46.48 100.04,46.6 99.79,46.6 99.79,40.51 104.36,40.51
  pour Bottom: 102.71,37.97 102.71,40.51 99.79,40.51 99.79,52.44 104.49,52.44 104.49,37.97
LED  (via drill 0.4)
  Top 0.508: R1.2 108.44,18.2 v106.5,18.2
  Bottom 0.508: v106.5,18.2 95.68,29.02 63.33,29.02 U$10.J9
MPM_VCC  (via drill 0.3 pad 0.55)
  Top 0.305: U2.2 99.42,49.26 v99.28,49.4 | v103.09,49.4 103.14,49.35 R3.2
  Bottom 0.305: v99.28,49.4 v103.09,49.4
PG
  Top 0.305: R3.1 101.24,48.63 U2.18
SCL
  Top 0.61: U$10.J22 58.42,5.5 35,5.5 31,1.5 21,1.5 18.99,3.51 JP1.4 22.62,7.5 JP2.4 22.62,29.62 27,34 27,35.6 22.55,40.05 U$5.SCL 22.55,42.55 24,44 48.5,44 54.21,38.29 J3.4
SDA
  Top 0.61: U$10.J23 57.38,7 26,7 | J3.3 51.67,38.83 50.5,40 35.5,40 31.47,35.97 | 30.5,35 25.16,29.66 JP2.5 | 30.5,35 31,35.5 | 31,35.5 31.47,35.97 | 31,35.5 30.93,35.5 30.47,35.97 | U$5.SDA 30.47,35.97 | 30.47,35.97 31.47,35.97 | 30.47,35.97 30.47,35.03 30.5,35 | 25.25,6.25 24.07,5.07 JP1.6 | 25.25,6.25 26,7 | JP2.5 25.16,7.84 26,7 | JP2.5 25.16,7 | 25.16,7 25.16,6.34 25.25,6.25 | 26,7 25.16,7
SRV_PWM
  Top 0.813: SERVOCON.3 110,32.01 98.49,20.5 64.5,20.5 56.15,12.15 U$10.J25
STAT_LED  (via drill 1)
  Top 0.508: v111.5,18 v111.5,18.01 111.48,18 R1.1
VCC
  pour Top (rank 2): 0,63 114,63 114,0 0,0

### Text on the board
tPlace: +7.4v | SparkFun / Openlog | CAM2 | ATmega328 | the mitochondria / of the PACE... | CAM3 | ADXL375 | . | SRV- | . | SRV+ | . | SRV_PWM | CAM4 | BMP388 | LED+ | CAM1
bPlace: P A C E | POWER & / AIRBRAKES / COMPUTE / ELEMENT | Best of luck and godspeed on your travels... | v1.0 (now with more ports!) | @WURocketry - Airbrakes 2023-2024